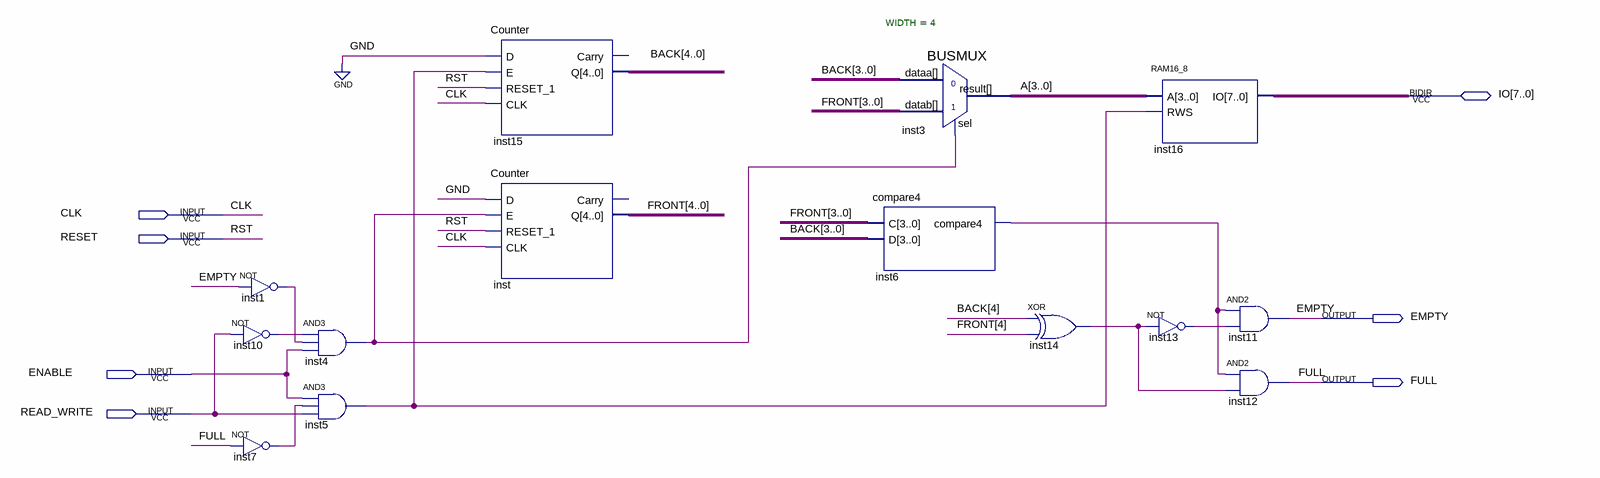
[diagram p0: schematic sheet]
// Quartus schematic FIFO.bdf as structural Verilog: 14 symbols, 7 pins
module FIFO (
  input  CLK,
  input  RESET,
  input  ENABLE,
  input  READ_WRITE,
  inout  [7:0] IO,
  output EMPTY,
  output FULL
);

  wire inst1_out, inst4_out, inst5_out, inst6_compare4, inst7_out, inst10_out, inst13_out, inst14_out;
  wire [3:0] A;
  wire [4:0] BACK, FRONT;

  not inst1 (inst1_out, EMPTY);
  not inst10 (inst10_out, READ_WRITE);
  not inst7 (inst7_out, FULL);
  and inst4 (inst4_out, inst10_out, inst1_out, ENABLE);
  and inst5 (inst5_out, ENABLE, inst7_out, READ_WRITE);
  Counter inst15 (.D(1'b0), .E(inst5_out), .RESET_1(RESET), .CLK(CLK), .Q(BACK));  // open: Carry
  Counter inst (.D(1'b0), .E(inst4_out), .RESET_1(RESET), .CLK(CLK), .Q(FRONT));  // open: Carry
  BUSMUX #(.WIDTH(4)) inst3 (.datab(FRONT[3:0]), .sel(inst4_out), .dataa(BACK[3:0]), .result(A));
  compare4 inst6 (.C(FRONT[3:0]), .D(BACK[3:0]), .compare4(inst6_compare4));
  xor inst14 (inst14_out, BACK[4], FRONT[4]);
  RAM16_8 inst16 (.A(A), .RWS(inst5_out), .IO(IO));
  not inst13 (inst13_out, inst14_out);
  and inst11 (EMPTY, inst6_compare4, inst13_out);
  and inst12 (FULL, inst6_compare4, inst14_out);

  // Other names for the same wires on the sheet: RST = RESET
endmodule
